# Altium schematic sheet 02_BLOCK_DIAGRAM.SchDoc: =TitleParameter
size A3; Address: Crete IL; Organization: ASISGUARD; Address1: Kemalpasa, Kemalpasa Cd. No:290 D:292H, 35060 Bornova/Izmir/Turkey
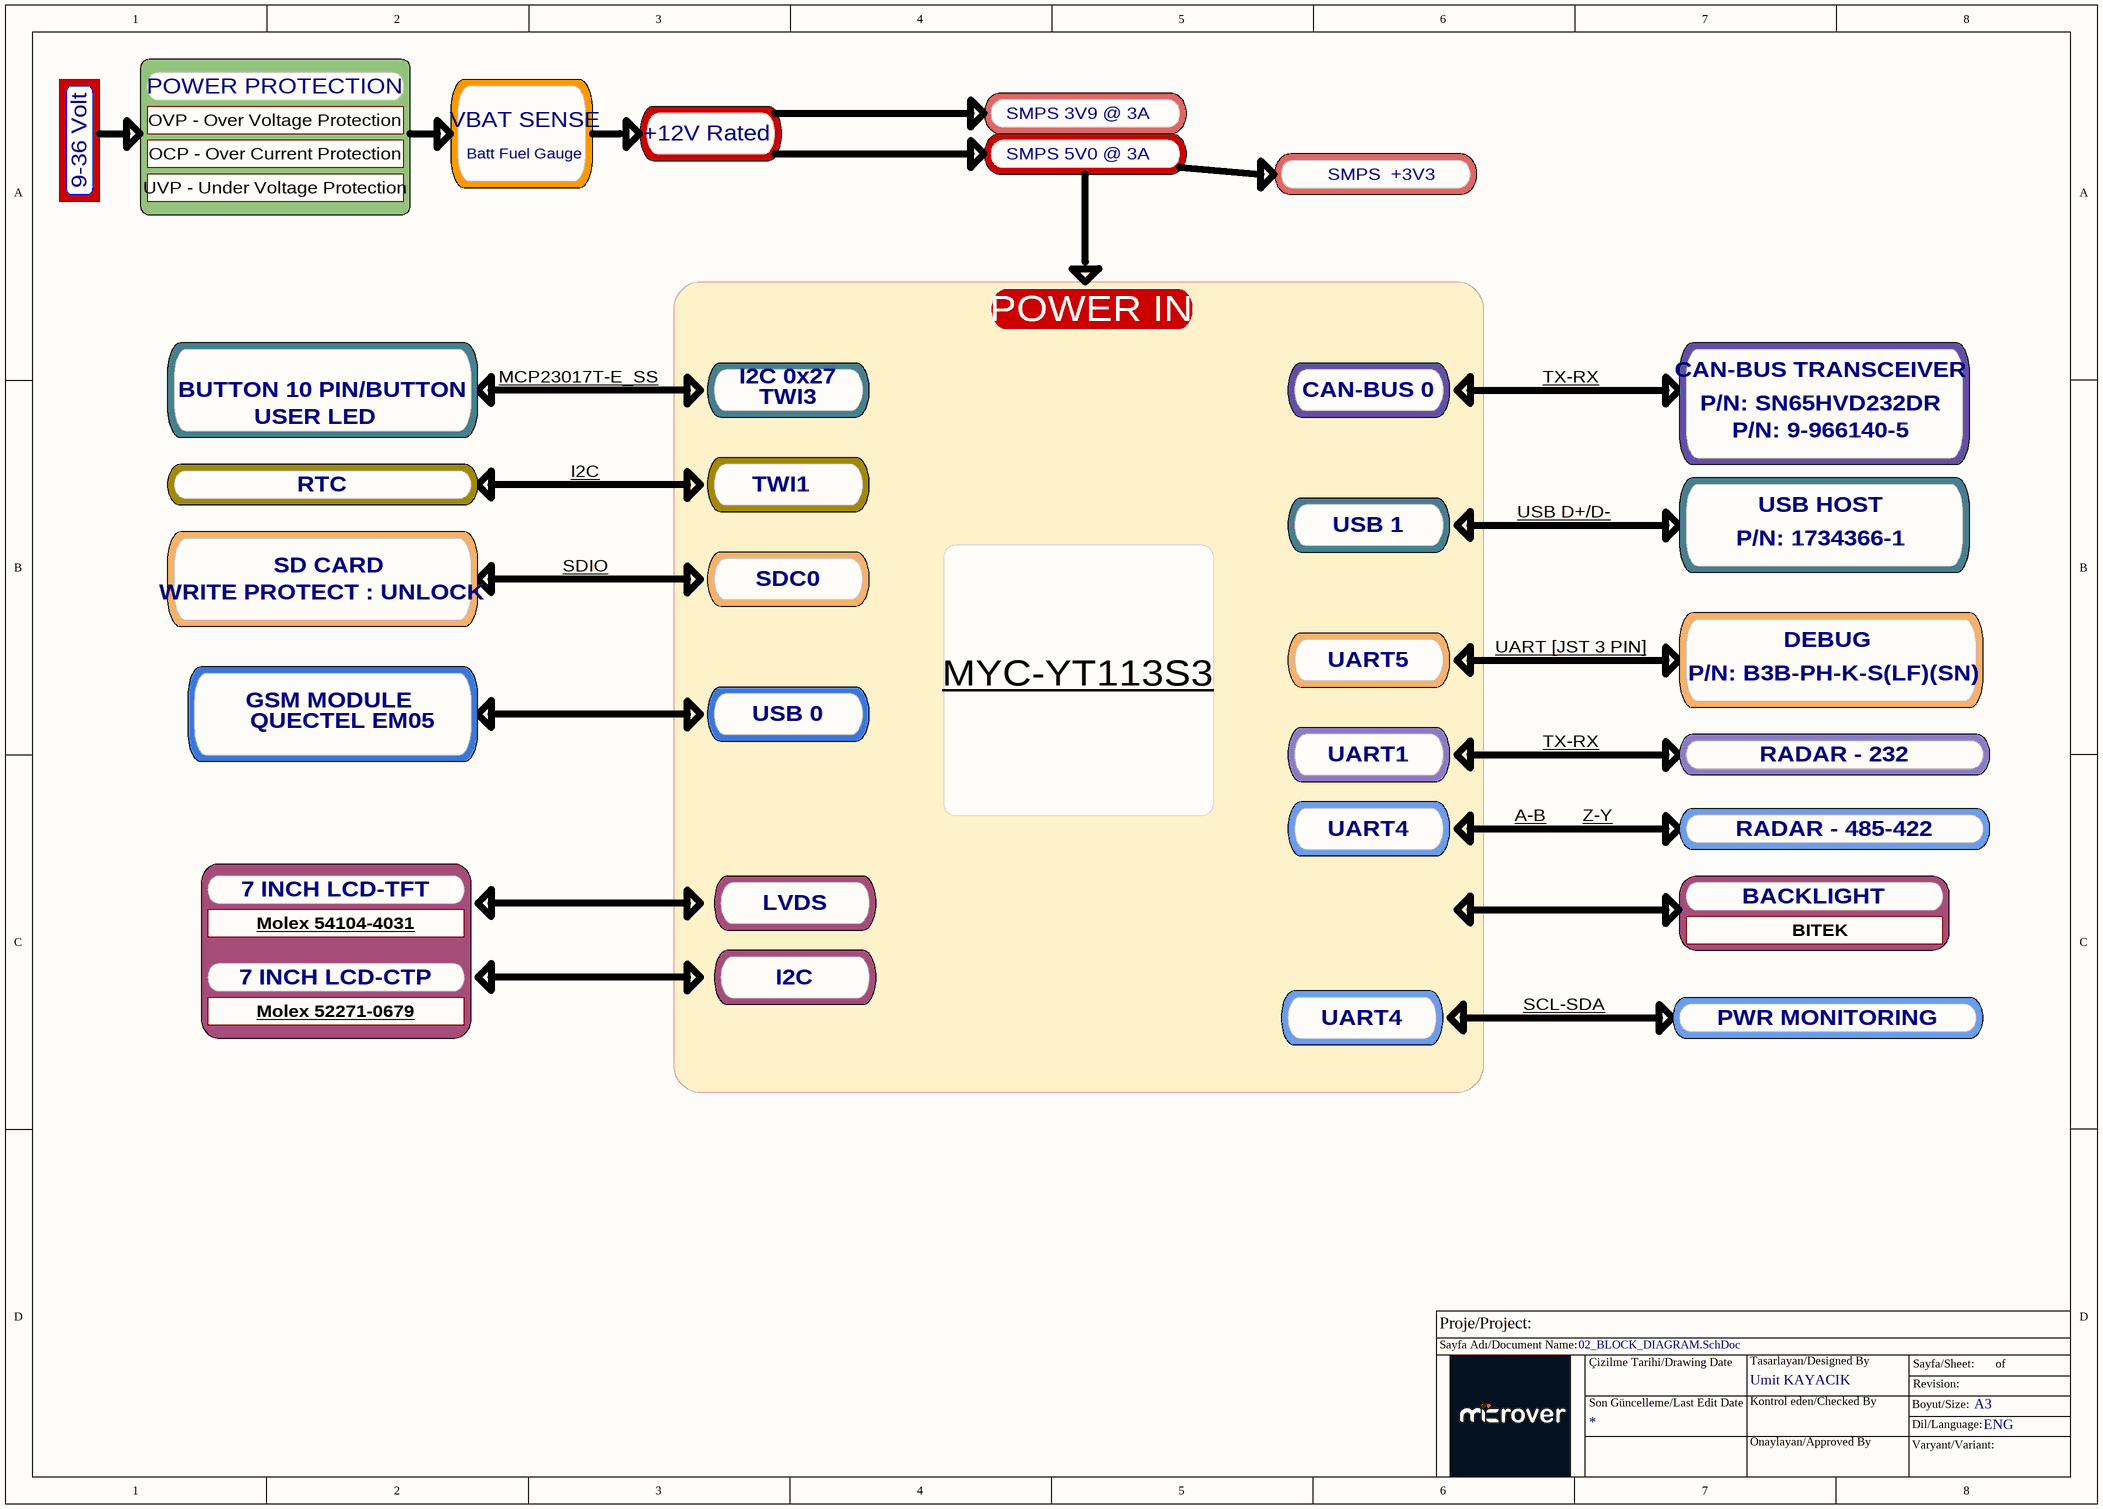
[diagram p0: 02_BLOCK_DIAGRAM.SchDoc]

## Notes on the sheet
- POWER PROTECTION
- SMPS 3V9 @ 3A
- 9-36 Volt
- OVP - Over Voltage Protection
- OCP - Over Current Protection
- UVP - Under Voltage Protection
- VBAT SENSE
- Batt Fuel Gauge
- +12V Rated
- SMPS 5V0 @ 3A
- SMPS  +3V3
- POWER IN
- MCP23017T-E_SS
- I2C 0x27
- TX-RX
- CAN-BUS TRANSCEIVER
- USER LED
- BUTTON 10 PIN/BUTTON
- TWI3
- CAN-BUS 0
- P/N: SN65HVD232DR
- P/N: 9-966140-5
- RTC
- I2C
- TWI1
- USB D+/D-
- USB HOST
- WRITE PROTECT : UNLOCK
- SD CARD
- SDIO
- SDC0
- USB 1
- P/N: 1734366-1
- UART [JST 3 PIN]
- DEBUG
- GSM MODULE
- QUECTEL EM05
- USB 0
- MYC-YT113S3 <https://www.myirtech.com/list.asp?id=722>
- UART5
- P/N: B3B-PH-K-S(LF)(SN)
- UART1
- RADAR - 232
- UART4
- A-B
- Z-Y
- RADAR - 485-422
- 7 INCH LCD-TFT
- Molex 54104-4031
- LVDS
- BACKLIGHT
- 7 INCH LCD-CTP
- BITEK
- Molex 52271-0679
- SCL-SDA
- PWR MONITORING
- Proje/Project:
- Sayfa Adı/Document Name:
- Çizilme Tarihi/Drawing Date
- Umit KAYACIK
- Tasarlayan/Designed By
- Sayfa/Sheet:
- Revision:
- of
- Son Güncelleme/Last Edit Date
- Kontrol eden/Checked By
- Onaylayan/Approved By
- Boyut/Size:
- Varyant/Variant:
- Dil/Language:
- A3
- ENG